# Altium schematic sheet A200T Top Level.SchDoc
size A1
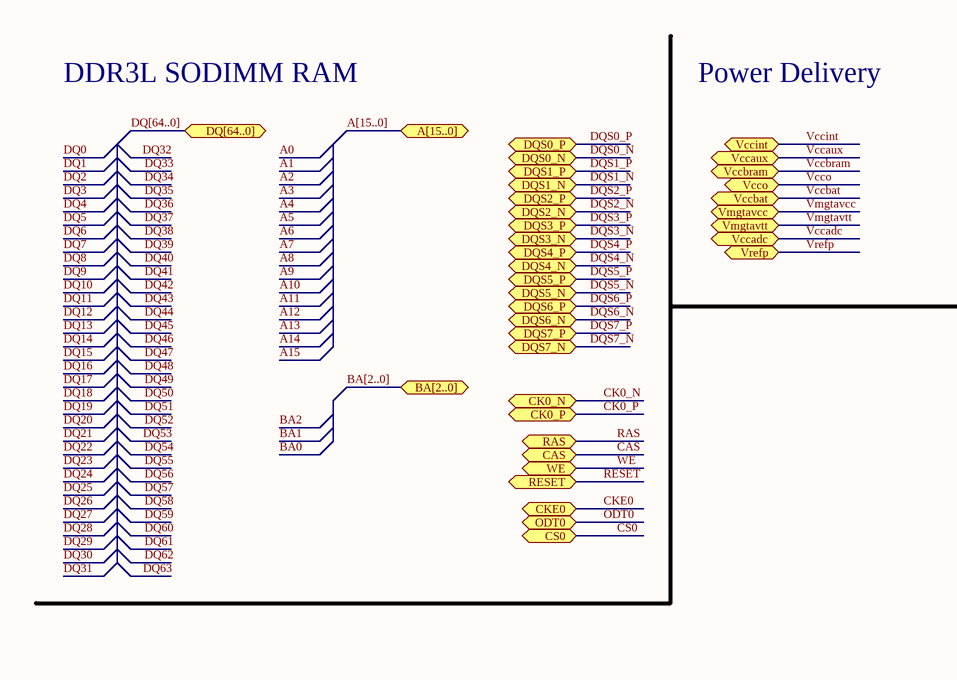
[diagram p0: A200T Top Level.SchDoc, top left]
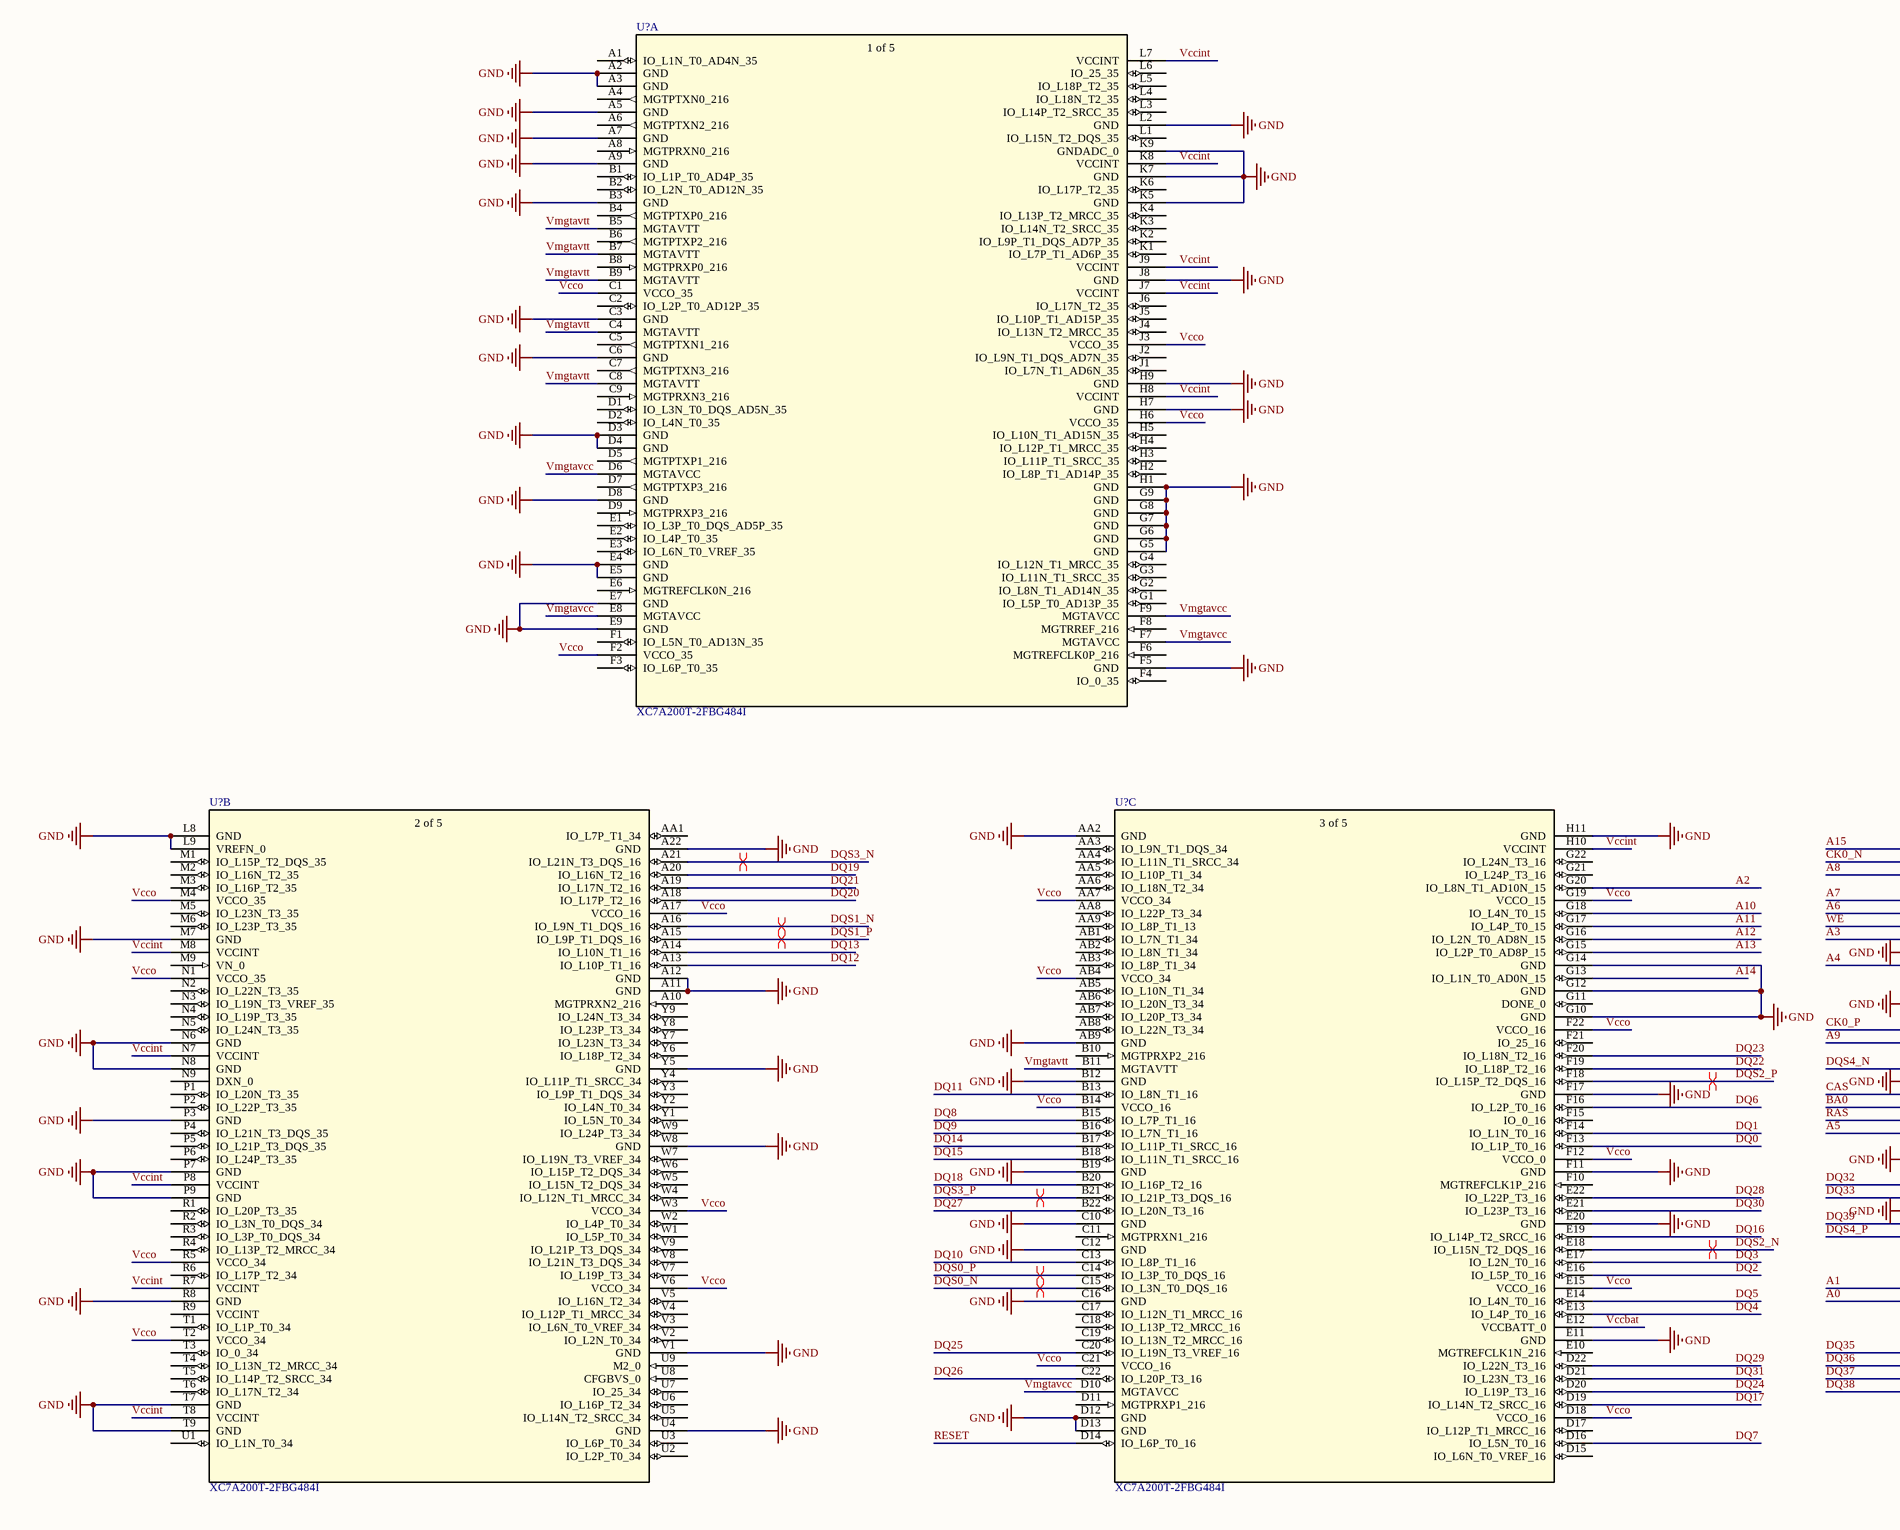
[diagram p1: A200T Top Level.SchDoc, bottom left]
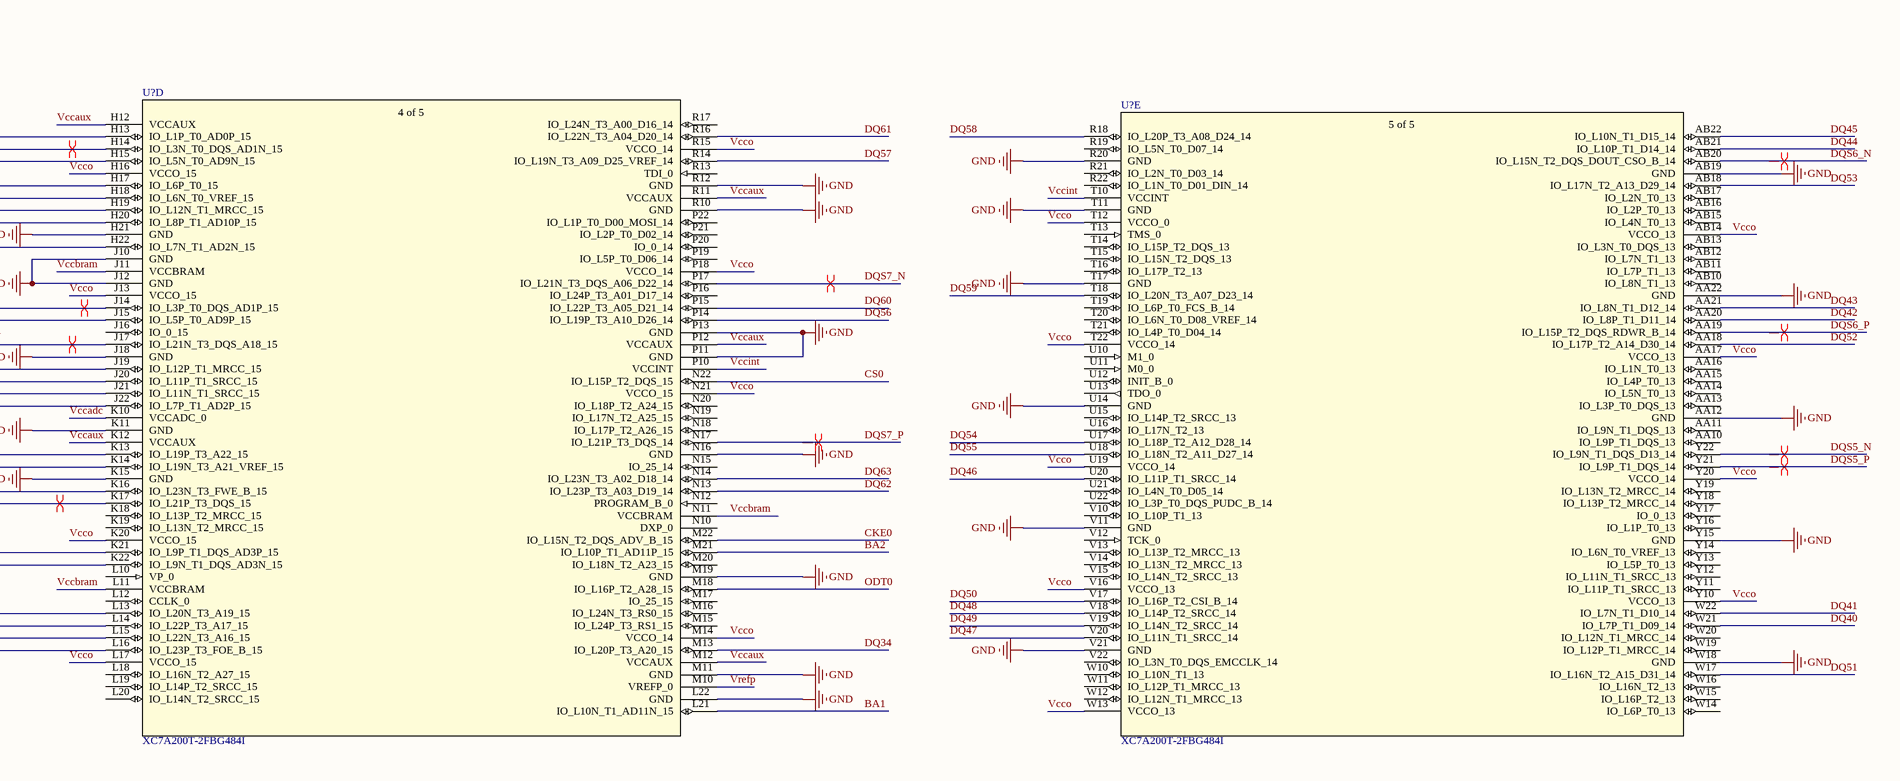
[diagram p2: A200T Top Level.SchDoc, bottom right]

## Parts
(Parts that share a designator on the sheet are numbered #1, #2 ... from top to bottom, then left to right.)
U?#1  XC7A200T-2FBG484I  [FBG484_XIL]  (part A of 5)
U?#2  XC7A200T-2FBG484I  [FBG484_XIL]  (part B of 5)
U?#3  XC7A200T-2FBG484I  [FBG484_XIL]  (part C of 5)
U?#4  XC7A200T-2FBG484I  [FBG484_XIL]  (part D of 5)
U?#5  XC7A200T-2FBG484I  [FBG484_XIL]  (part E of 5)

## Ports
A[15..0] (bidir), BA[2..0] (bidir), CAS (bidir), CK0_N (bidir), CK0_P (bidir), CKE0 (bidir), CS0 (bidir), DQ[64..0] (bidir), DQS0_N (bidir), DQS0_P (bidir), DQS1_N (bidir), DQS1_P (bidir), DQS2_N (bidir), DQS2_P (bidir), DQS3_N (bidir), DQS3_P (bidir), DQS4_N (bidir), DQS4_P (bidir), DQS5_N (bidir), DQS5_P (bidir), DQS6_N (bidir), DQS6_P (bidir), DQS7_N (bidir), DQS7_P (bidir), ODT0 (bidir), RAS (bidir), RESET (bidir), Vccadc (bidir), Vccaux (bidir), Vccbat (bidir), Vccbram (bidir), Vccint (bidir), Vcco (bidir), Vmgtavcc (bidir), Vmgtavtt (bidir), Vrefp (bidir), WE (bidir)

## Nets
GND: U?#1.A2(GND) U?#1.A3(GND) U?#1.A5(GND) U?#1.A7(GND) U?#1.A9(GND) U?#1.B3(GND) U?#1.C3(GND) U?#1.C6(GND) U?#1.D3(GND) U?#1.D4(GND) U?#1.D8(GND) U?#1.E4(GND) U?#1.E5(GND) U?#1.E7(GND) U?#1.E9(GND) U?#1.F5(GND) U?#1.G5(GND) U?#1.G6(GND) U?#1.G7(GND) U?#1.G8(GND) U?#1.G9(GND) U?#1.H1(GND) U?#1.H7(GND) U?#1.H9(GND) U?#1.J8(GND) U?#1.K5(GND) U?#1.K7(GND) U?#1.K9(GNDADC_0) U?#1.L2(GND) U?#2.A11(GND) U?#2.A12(GND) U?#2.A22(GND) U?#2.L8(GND) U?#2.L9(VREFN_0) U?#2.M7(GND) U?#2.N6(GND) U?#2.N8(GND) U?#2.P3(GND) U?#2.P7(GND) U?#2.P9(GND) U?#2.R8(GND) U?#2.T7(GND) U?#2.T9(GND) U?#2.U4(GND) U?#2.V1(GND) U?#2.W8(GND) U?#2.Y5(GND) U?#3.AA2(GND) U?#3.AB9(GND) U?#3.B12(GND) U?#3.B19(GND) U?#3.C10(GND) U?#3.C12(GND) U?#3.C16(GND) U?#3.D12(GND) U?#3.D13(GND) U?#3.E11(GND) U?#3.E20(GND) U?#3.F11(GND) U?#3.F17(GND) U?#3.G10(GND) U?#3.G12(GND) U?#3.G14(GND) U?#3.H11(GND) U?#4.H21(GND) U?#4.J10(GND) U?#4.J12(GND) U?#4.J18(GND) U?#4.K11(GND) U?#4.K15(GND) U?#4.L22(GND) U?#4.M11(GND) U?#4.M19(GND) U?#4.N16(GND) U?#4.P11(GND) U?#4.P13(GND) U?#4.R10(GND) U?#4.R12(GND) U?#5.AA12(GND) U?#5.AA22(GND) U?#5.AB19(GND) U?#5.R20(GND) U?#5.T11(GND) U?#5.T17(GND) U?#5.U14(GND) U?#5.V11(GND) U?#5.V21(GND) U?#5.W18(GND) U?#5.Y15(GND)
A0: U?#4.K22(IO_L9N_T1_DQS_AD3N_15)
A1: U?#4.K21(IO_L9P_T1_DQS_AD3P_15)
A2: U?#3.G20(IO_L8N_T1_AD10N_15)
A3: U?#4.H20(IO_L8P_T1_AD10P_15)
A4: U?#4.H22(IO_L7N_T1_AD2N_15)
A5: U?#4.J22(IO_L7P_T1_AD2P_15)
A6: U?#4.H18(IO_L6N_T0_VREF_15)
A7: U?#4.H17(IO_L6P_T0_15)
A8: U?#4.H15(IO_L5N_T0_AD9N_15)
A9: U?#4.J15(IO_L5P_T0_AD9P_15)
A10: U?#3.G18(IO_L4N_T0_15)
A11: U?#3.G17(IO_L4P_T0_15)
A12: U?#3.G16(IO_L2N_T0_AD8N_15)
A13: U?#3.G15(IO_L2P_T0_AD8P_15)
A14: U?#3.G13(IO_L1N_T0_AD0N_15)
A15: U?#4.H13(IO_L1P_T0_AD0P_15)
BA0: U?#4.J20(IO_L11P_T1_SRCC_15)
BA1: U?#4.L21(IO_L10N_T1_AD11N_15)
BA2: U?#4.M21(IO_L10P_T1_AD11P_15)
CAS: U?#4.J19(IO_L12P_T1_MRCC_15) ; port CAS
CK0_N: U?#4.H14(IO_L3N_T0_DQS_AD1N_15) ; port CK0_N
CK0_P: U?#4.J14(IO_L3P_T0_DQS_AD1P_15) ; port CK0_P
CKE0: U?#4.M22(IO_L15N_T2_DQS_ADV_B_15) ; port CKE0
CS0: U?#4.N22(IO_L15P_T2_DQS_15) ; port CS0
DQ0: U?#3.F13(IO_L1P_T0_16)
DQ1: U?#3.F14(IO_L1N_T0_16)
DQ2: U?#3.E16(IO_L5P_T0_16)
DQ3: U?#3.E17(IO_L2N_T0_16)
DQ4: U?#3.E13(IO_L4P_T0_16)
DQ5: U?#3.E14(IO_L4N_T0_16)
DQ6: U?#3.F16(IO_L2P_T0_16)
DQ7: U?#3.D16(IO_L5N_T0_16)
DQ8: U?#3.B15(IO_L7P_T1_16)
DQ9: U?#3.B16(IO_L7N_T1_16)
DQ10: U?#3.C13(IO_L8P_T1_16)
DQ11: U?#3.B13(IO_L8N_T1_16)
DQ12: U?#2.A13(IO_L10P_T1_16)
DQ13: U?#2.A14(IO_L10N_T1_16)
DQ14: U?#3.B17(IO_L11P_T1_SRCC_16)
DQ15: U?#3.B18(IO_L11N_T1_SRCC_16)
DQ16: U?#3.E19(IO_L14P_T2_SRCC_16)
DQ17: U?#3.D19(IO_L14N_T2_SRCC_16)
DQ18: U?#3.B20(IO_L16P_T2_16)
DQ19: U?#2.A20(IO_L16N_T2_16)
DQ20: U?#2.A18(IO_L17P_T2_16)
DQ21: U?#2.A19(IO_L17N_T2_16)
DQ22: U?#3.F19(IO_L18P_T2_16)
DQ23: U?#3.F20(IO_L18N_T2_16)
DQ24: U?#3.D20(IO_L19P_T3_16)
DQ25: U?#3.C20(IO_L19N_T3_VREF_16)
DQ26: U?#3.C22(IO_L20P_T3_16)
DQ27: U?#3.B22(IO_L20N_T3_16)
DQ28: U?#3.E22(IO_L22P_T3_16)
DQ29: U?#3.D22(IO_L22N_T3_16)
DQ30: U?#3.E21(IO_L23P_T3_16)
DQ31: U?#3.D21(IO_L23N_T3_16)
DQ32: U?#4.K13(IO_L19P_T3_A22_15)
DQ33: U?#4.K14(IO_L19N_T3_A21_VREF_15)
DQ34: U?#4.M13(IO_L20P_T3_A20_15)
DQ35: U?#4.L13(IO_L20N_T3_A19_15)
DQ36: U?#4.L14(IO_L22P_T3_A17_15)
DQ37: U?#4.L15(IO_L22N_T3_A16_15)
DQ38: U?#4.L16(IO_L23P_T3_FOE_B_15)
DQ39: U?#4.K16(IO_L23N_T3_FWE_B_15)
DQ40: U?#5.W21(IO_L7P_T1_D09_14)
DQ41: U?#5.W22(IO_L7N_T1_D10_14)
DQ42: U?#5.AA20(IO_L8P_T1_D11_14)
DQ43: U?#5.AA21(IO_L8N_T1_D12_14)
DQ44: U?#5.AB21(IO_L10P_T1_D14_14)
DQ45: U?#5.AB22(IO_L10N_T1_D15_14)
DQ46: U?#5.U20(IO_L11P_T1_SRCC_14)
DQ47: U?#5.V20(IO_L11N_T1_SRCC_14)
DQ48: U?#5.V18(IO_L14P_T2_SRCC_14)
DQ49: U?#5.V19(IO_L14N_T2_SRCC_14)
DQ50: U?#5.V17(IO_L16P_T2_CSI_B_14)
DQ51: U?#5.W17(IO_L16N_T2_A15_D31_14)
DQ52: U?#5.AA18(IO_L17P_T2_A14_D30_14)
DQ53: U?#5.AB18(IO_L17N_T2_A13_D29_14)
DQ54: U?#5.U17(IO_L18P_T2_A12_D28_14)
DQ55: U?#5.U18(IO_L18N_T2_A11_D27_14)
DQ56: U?#4.P14(IO_L19P_T3_A10_D26_14)
DQ57: U?#4.R14(IO_L19N_T3_A09_D25_VREF_14)
DQ58: U?#5.R18(IO_L20P_T3_A08_D24_14)
DQ59: U?#5.T18(IO_L20N_T3_A07_D23_14)
DQ60: U?#4.P15(IO_L22P_T3_A05_D21_14)
DQ61: U?#4.R16(IO_L22N_T3_A04_D20_14)
DQ62: U?#4.N13(IO_L23P_T3_A03_D19_14)
DQ63: U?#4.N14(IO_L23N_T3_A02_D18_14)
DQS0_N: U?#3.C15(IO_L3N_T0_DQS_16) ; port DQS0_N
DQS0_P: U?#3.C14(IO_L3P_T0_DQS_16) ; port DQS0_P
DQS1_N: U?#2.A16(IO_L9N_T1_DQS_16) ; port DQS1_N
DQS1_P: U?#2.A15(IO_L9P_T1_DQS_16) ; port DQS1_P
DQS2_N: U?#3.E18(IO_L15N_T2_DQS_16) ; port DQS2_N
DQS2_P: U?#3.F18(IO_L15P_T2_DQS_16) ; port DQS2_P
DQS3_N: U?#2.A21(IO_L21N_T3_DQS_16) ; port DQS3_N
DQS3_P: U?#3.B21(IO_L21P_T3_DQS_16) ; port DQS3_P
DQS4_N: U?#4.J17(IO_L21N_T3_DQS_A18_15) ; port DQS4_N
DQS4_P: U?#4.K17(IO_L21P_T3_DQS_15) ; port DQS4_P
DQS5_N: U?#5.Y22(IO_L9N_T1_DQS_D13_14) ; port DQS5_N
DQS5_P: U?#5.Y21(IO_L9P_T1_DQS_14) ; port DQS5_P
DQS6_N: U?#5.AB20(IO_L15N_T2_DQS_DOUT_CSO_B_14) ; port DQS6_N
DQS6_P: U?#5.AA19(IO_L15P_T2_DQS_RDWR_B_14) ; port DQS6_P
DQS7_N: U?#4.P17(IO_L21N_T3_DQS_A06_D22_14) ; port DQS7_N
DQS7_P: U?#4.N17(IO_L21P_T3_DQS_14) ; port DQS7_P
ODT0: U?#4.M18(IO_L16P_T2_A28_15) ; port ODT0
RAS: U?#4.J21(IO_L11N_T1_SRCC_15) ; port RAS
RESET: U?#3.D14(IO_L6P_T0_16) ; port RESET
Vccadc: U?#4.K10(VCCADC_0) ; port Vccadc
Vccaux: U?#4.H12(VCCAUX) U?#4.K12(VCCAUX) U?#4.M12(VCCAUX) U?#4.P12(VCCAUX) U?#4.R11(VCCAUX) ; port Vccaux
Vccbat: U?#3.E12(VCCBATT_0) ; port Vccbat
Vccbram: U?#4.J11(VCCBRAM) U?#4.L11(VCCBRAM) U?#4.N11(VCCBRAM) ; port Vccbram
Vccint: U?#1.H8(VCCINT) U?#1.J7(VCCINT) U?#1.J9(VCCINT) U?#1.K8(VCCINT) U?#1.L7(VCCINT) U?#2.M8(VCCINT) U?#2.N7(VCCINT) U?#2.P8(VCCINT) U?#2.R7(VCCINT) U?#2.T8(VCCINT) U?#3.H10(VCCINT) U?#4.P10(VCCINT) U?#5.T10(VCCINT) ; port Vccint
Vcco: U?#1.C1(VCCO_35) U?#1.F2(VCCO_35) U?#1.H6(VCCO_35) U?#1.J3(VCCO_35) U?#2.A17(VCCO_16) U?#2.M4(VCCO_35) U?#2.N1(VCCO_35) U?#2.R5(VCCO_34) U?#2.T2(VCCO_34) U?#2.V6(VCCO_34) U?#2.W3(VCCO_34) U?#3.AA7(VCCO_34) U?#3.AB4(VCCO_34) U?#3.B14(VCCO_16) U?#3.C21(VCCO_16) U?#3.D18(VCCO_16) U?#3.E15(VCCO_16) U?#3.F12(VCCO_0) U?#3.F22(VCCO_16) U?#3.G19(VCCO_15) U?#4.H16(VCCO_15) U?#4.J13(VCCO_15) U?#4.K20(VCCO_15) U?#4.L17(VCCO_15) U?#4.M14(VCCO_14) U?#4.N21(VCCO_15) U?#4.P18(VCCO_14) U?#4.R15(VCCO_14) U?#5.AA17(VCCO_13) U?#5.AB14(VCCO_13) U?#5.T12(VCCO_0) U?#5.T22(VCCO_14) U?#5.U19(VCCO_14) U?#5.V16(VCCO_13) U?#5.W13(VCCO_13) U?#5.Y10(VCCO_13) U?#5.Y20(VCCO_14) ; port Vcco
Vmgtavcc: U?#1.D6(MGTAVCC) U?#1.E8(MGTAVCC) U?#1.F7(MGTAVCC) U?#1.F9(MGTAVCC) U?#3.D10(MGTAVCC) ; port Vmgtavcc
Vmgtavtt: U?#1.B5(MGTAVTT) U?#1.B7(MGTAVTT) U?#1.B9(MGTAVTT) U?#1.C4(MGTAVTT) U?#1.C8(MGTAVTT) U?#3.B11(MGTAVTT) ; port Vmgtavtt
Vrefp: U?#4.M10(VREFP_0) ; port Vrefp
WE: U?#4.H19(IO_L12N_T1_MRCC_15) ; port WE

Not connected (* = marked no-connect by the designer): U?#1 A1(IO_L1N_T0_AD4N_35) A4(MGTPTXN0_216) A6(MGTPTXN2_216) A8(MGTPRXN0_216) B1(IO_L1P_T0_AD4P_35) B2(IO_L2N_T0_AD12N_35) B4(MGTPTXP0_216) B6(MGTPTXP2_216) B8(MGTPRXP0_216) C2(IO_L2P_T0_AD12P_35) C5(MGTPTXN1_216) C7(MGTPTXN3_216) C9(MGTPRXN3_216) D1(IO_L3N_T0_DQS_AD5N_35) D2(IO_L4N_T0_35) D5(MGTPTXP1_216) D7(MGTPTXP3_216) D9(MGTPRXP3_216) E1(IO_L3P_T0_DQS_AD5P_35) E2(IO_L4P_T0_35) E3(IO_L6N_T0_VREF_35) E6(MGTREFCLK0N_216) F1(IO_L5N_T0_AD13N_35) F3(IO_L6P_T0_35) F4(IO_0_35) F6(MGTREFCLK0P_216) F8(MGTRREF_216) G1(IO_L5P_T0_AD13P_35) G2(IO_L8N_T1_AD14N_35) G3(IO_L11N_T1_SRCC_35) G4(IO_L12N_T1_MRCC_35) H2(IO_L8P_T1_AD14P_35) H3(IO_L11P_T1_SRCC_35) H4(IO_L12P_T1_MRCC_35) H5(IO_L10N_T1_AD15N_35) J1(IO_L7N_T1_AD6N_35) J2(IO_L9N_T1_DQS_AD7N_35) J4(IO_L13N_T2_MRCC_35) J5(IO_L10P_T1_AD15P_35) J6(IO_L17N_T2_35) K1(IO_L7P_T1_AD6P_35) K2(IO_L9P_T1_DQS_AD7P_35) K3(IO_L14N_T2_SRCC_35) K4(IO_L13P_T2_MRCC_35) K6(IO_L17P_T2_35) L1(IO_L15N_T2_DQS_35) L3(IO_L14P_T2_SRCC_35) L4(IO_L18N_T2_35) L5(IO_L18P_T2_35) L6(IO_25_35); U?#2 A10(MGTPRXN2_216) AA1(IO_L7P_T1_34) M1(IO_L15P_T2_DQS_35) M2(IO_L16N_T2_35) M3(IO_L16P_T2_35) M5(IO_L23N_T3_35) M6(IO_L23P_T3_35) M9(VN_0) N2(IO_L22N_T3_35) N3(IO_L19N_T3_VREF_35) N4(IO_L19P_T3_35) N5(IO_L24N_T3_35) N9(DXN_0) P1(IO_L20N_T3_35) P2(IO_L22P_T3_35) P4(IO_L21N_T3_DQS_35) P5(IO_L21P_T3_DQS_35) P6(IO_L24P_T3_35) R1(IO_L20P_T3_35) R2(IO_L3N_T0_DQS_34) R3(IO_L3P_T0_DQS_34) R4(IO_L13P_T2_MRCC_34) R6(IO_L17P_T2_34) R9(VCCINT) T1(IO_L1P_T0_34) T3(IO_0_34) T4(IO_L13N_T2_MRCC_34) T5(IO_L14P_T2_SRCC_34) T6(IO_L17N_T2_34) U1(IO_L1N_T0_34) U2(IO_L2P_T0_34) U3(IO_L6P_T0_34) U5(IO_L14N_T2_SRCC_34) U6(IO_L16P_T2_34) U7(IO_25_34) U8(CFGBVS_0) U9(M2_0) V2(IO_L2N_T0_34) V3(IO_L6N_T0_VREF_34) V4(IO_L12P_T1_MRCC_34) V5(IO_L16N_T2_34) V7(IO_L19P_T3_34) V8(IO_L21N_T3_DQS_34) V9(IO_L21P_T3_DQS_34) W1(IO_L5P_T0_34) W2(IO_L4P_T0_34) W4(IO_L12N_T1_MRCC_34) W5(IO_L15N_T2_DQS_34) W6(IO_L15P_T2_DQS_34) W7(IO_L19N_T3_VREF_34) W9(IO_L24P_T3_34) Y1(IO_L5N_T0_34) Y2(IO_L4N_T0_34) Y3(IO_L9P_T1_DQS_34) Y4(IO_L11P_T1_SRCC_34) Y6(IO_L18P_T2_34) Y7(IO_L23N_T3_34) Y8(IO_L23P_T3_34) Y9(IO_L24N_T3_34); U?#3 AA3(IO_L9N_T1_DQS_34) AA4(IO_L11N_T1_SRCC_34) AA5(IO_L10P_T1_34) AA6(IO_L18N_T2_34) AA8(IO_L22P_T3_34) AA9(IO_L8P_T1_13) AB1(IO_L7N_T1_34) AB2(IO_L8N_T1_34) AB3(IO_L8P_T1_34) AB5(IO_L10N_T1_34) AB6(IO_L20N_T3_34) AB7(IO_L20P_T3_34) AB8(IO_L22N_T3_34) B10(MGTPRXP2_216) C11(MGTPRXN1_216) C17(IO_L12N_T1_MRCC_16) C18(IO_L13P_T2_MRCC_16) C19(IO_L13N_T2_MRCC_16) D11(MGTPRXP1_216) D15(IO_L6N_T0_VREF_16) D17(IO_L12P_T1_MRCC_16) E10(MGTREFCLK1N_216) F10(MGTREFCLK1P_216) F15(IO_0_16) F21(IO_25_16) G11(DONE_0) G21(IO_L24P_T3_16) G22(IO_L24N_T3_16); U?#4 J16(IO_0_15) K18(IO_L13P_T2_MRCC_15) K19(IO_L13N_T2_MRCC_15) L10(VP_0) L12(CCLK_0) L18(IO_L16N_T2_A27_15) L19(IO_L14P_T2_SRCC_15) L20(IO_L14N_T2_SRCC_15) M15(IO_L24P_T3_RS1_15) M16(IO_L24N_T3_RS0_15) M17(IO_25_15) M20(IO_L18N_T2_A23_15) N10(DXP_0) N12(PROGRAM_B_0) N15(IO_25_14) N18(IO_L17P_T2_A26_15) N19(IO_L17N_T2_A25_15) N20(IO_L18P_T2_A24_15) P16(IO_L24P_T3_A01_D17_14) P19(IO_L5P_T0_D06_14) P20(IO_0_14) P21(IO_L2P_T0_D02_14) P22(IO_L1P_T0_D00_MOSI_14) R13(TDI_0) R17(IO_L24N_T3_A00_D16_14); U?#5 AA10(IO_L9P_T1_DQS_13) AA11(IO_L9N_T1_DQS_13) AA13(IO_L3P_T0_DQS_13) AA14(IO_L5N_T0_13) AA15(IO_L4P_T0_13) AA16(IO_L1N_T0_13) AB10(IO_L8N_T1_13) AB11(IO_L7P_T1_13) AB12(IO_L7N_T1_13) AB13(IO_L3N_T0_DQS_13) AB15(IO_L4N_T0_13) AB16(IO_L2P_T0_13) AB17(IO_L2N_T0_13) R19(IO_L5N_T0_D07_14) R21(IO_L2N_T0_D03_14) R22(IO_L1N_T0_D01_DIN_14) T13(TMS_0) T14(IO_L15P_T2_DQS_13) T15(IO_L15N_T2_DQS_13) T16(IO_L17P_T2_13) T19(IO_L6P_T0_FCS_B_14) T20(IO_L6N_T0_D08_VREF_14) T21(IO_L4P_T0_D04_14) U10(M1_0) U11(M0_0) U12(INIT_B_0) U13(TDO_0) U15(IO_L14P_T2_SRCC_13) U16(IO_L17N_T2_13) U21(IO_L4N_T0_D05_14) U22(IO_L3P_T0_DQS_PUDC_B_14) V10(IO_L10P_T1_13) V12(TCK_0) V13(IO_L13P_T2_MRCC_13) V14(IO_L13N_T2_MRCC_13) V15(IO_L14N_T2_SRCC_13) V22(IO_L3N_T0_DQS_EMCCLK_14) W10(IO_L10N_T1_13) W11(IO_L12P_T1_MRCC_13) W12(IO_L12N_T1_MRCC_13) W14(IO_L6P_T0_13) W15(IO_L16P_T2_13) W16(IO_L16N_T2_13) W19(IO_L12P_T1_MRCC_14) W20(IO_L12N_T1_MRCC_14) Y11(IO_L11P_T1_SRCC_13) Y12(IO_L11N_T1_SRCC_13) Y13(IO_L5P_T0_13) Y14(IO_L6N_T0_VREF_13) Y16(IO_L1P_T0_13) Y17(IO_0_13) Y18(IO_L13P_T2_MRCC_14) Y19(IO_L13N_T2_MRCC_14)

## Buses and harness runs
bus A[15..0] = port A[15..0]
bus BA[2..0] = port BA[2..0]
bus DQ[64..0] = port DQ[64..0]

## Layout directives
differential pair: CK0_N, CK0_P, DQS0_N, DQS0_P, DQS1_N, DQS1_P, DQS2_N, DQS2_P, DQS3_N, DQS3_P, DQS4_N, DQS4_P, DQS5_N, DQS5_P, DQS6_N, DQS6_P, DQS7_N, DQS7_P

## Notes on the sheet
- DDR3L SODIMM RAM
- Power Delivery
- (in symbol XC7A200T-2FBG484I, part A) 1 of 5
- (in symbol XC7A200T-2FBG484I, part B) 2 of 5
- (in symbol XC7A200T-2FBG484I, part C) 3 of 5
- (in symbol XC7A200T-2FBG484I, part D) 4 of 5
- (in symbol XC7A200T-2FBG484I, part E) 5 of 5

## Library data of the parts
U?#1-U?#5 = XC7A200T-2FBG484I: No Description Available; Vendor: Xilinx Inc; Built_By: EMA_Cory; SourceLibrary: Xilinx_2020-08-04; Datasheet: https://www.xilinx.com/support/documentation/user_guides/ug475_7Series_Pkg_Pinout.pdf; Manufacturer_Part_Number: XC7A200T-2FBG484I; Copyright: Copyright (C) 2018 Accelerated Designs. All rights reserved; RefDes: RefDes; Type: DEV